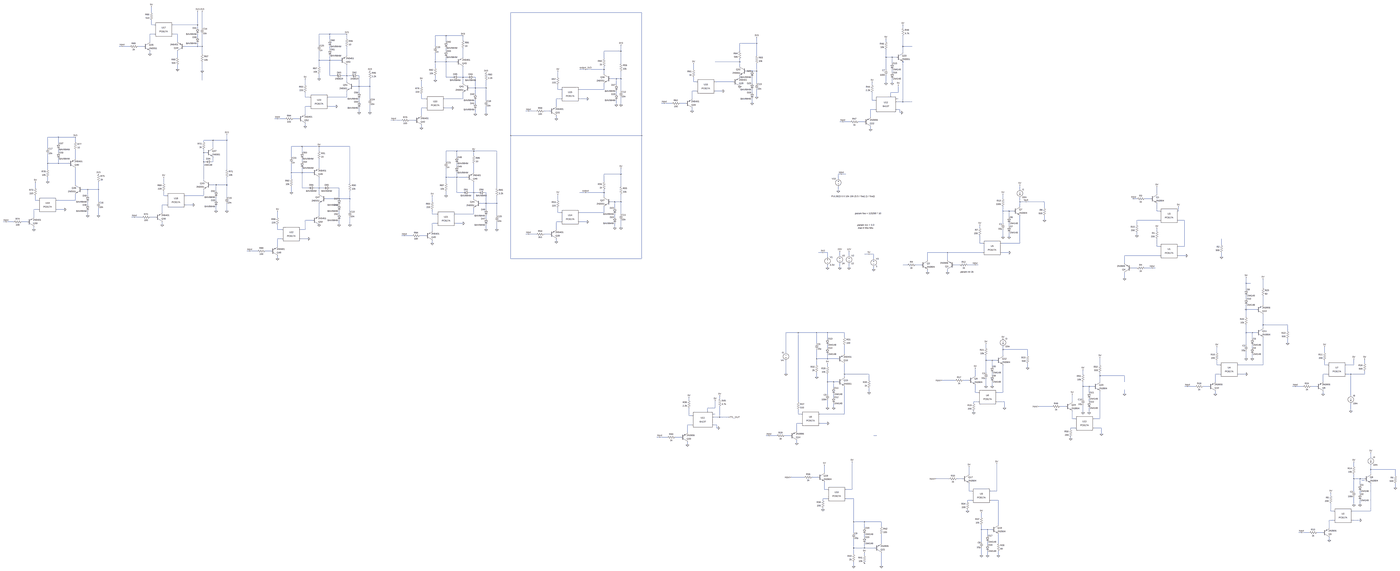
[diagram p0: schematic UART_isolation.asc, whole sheet]
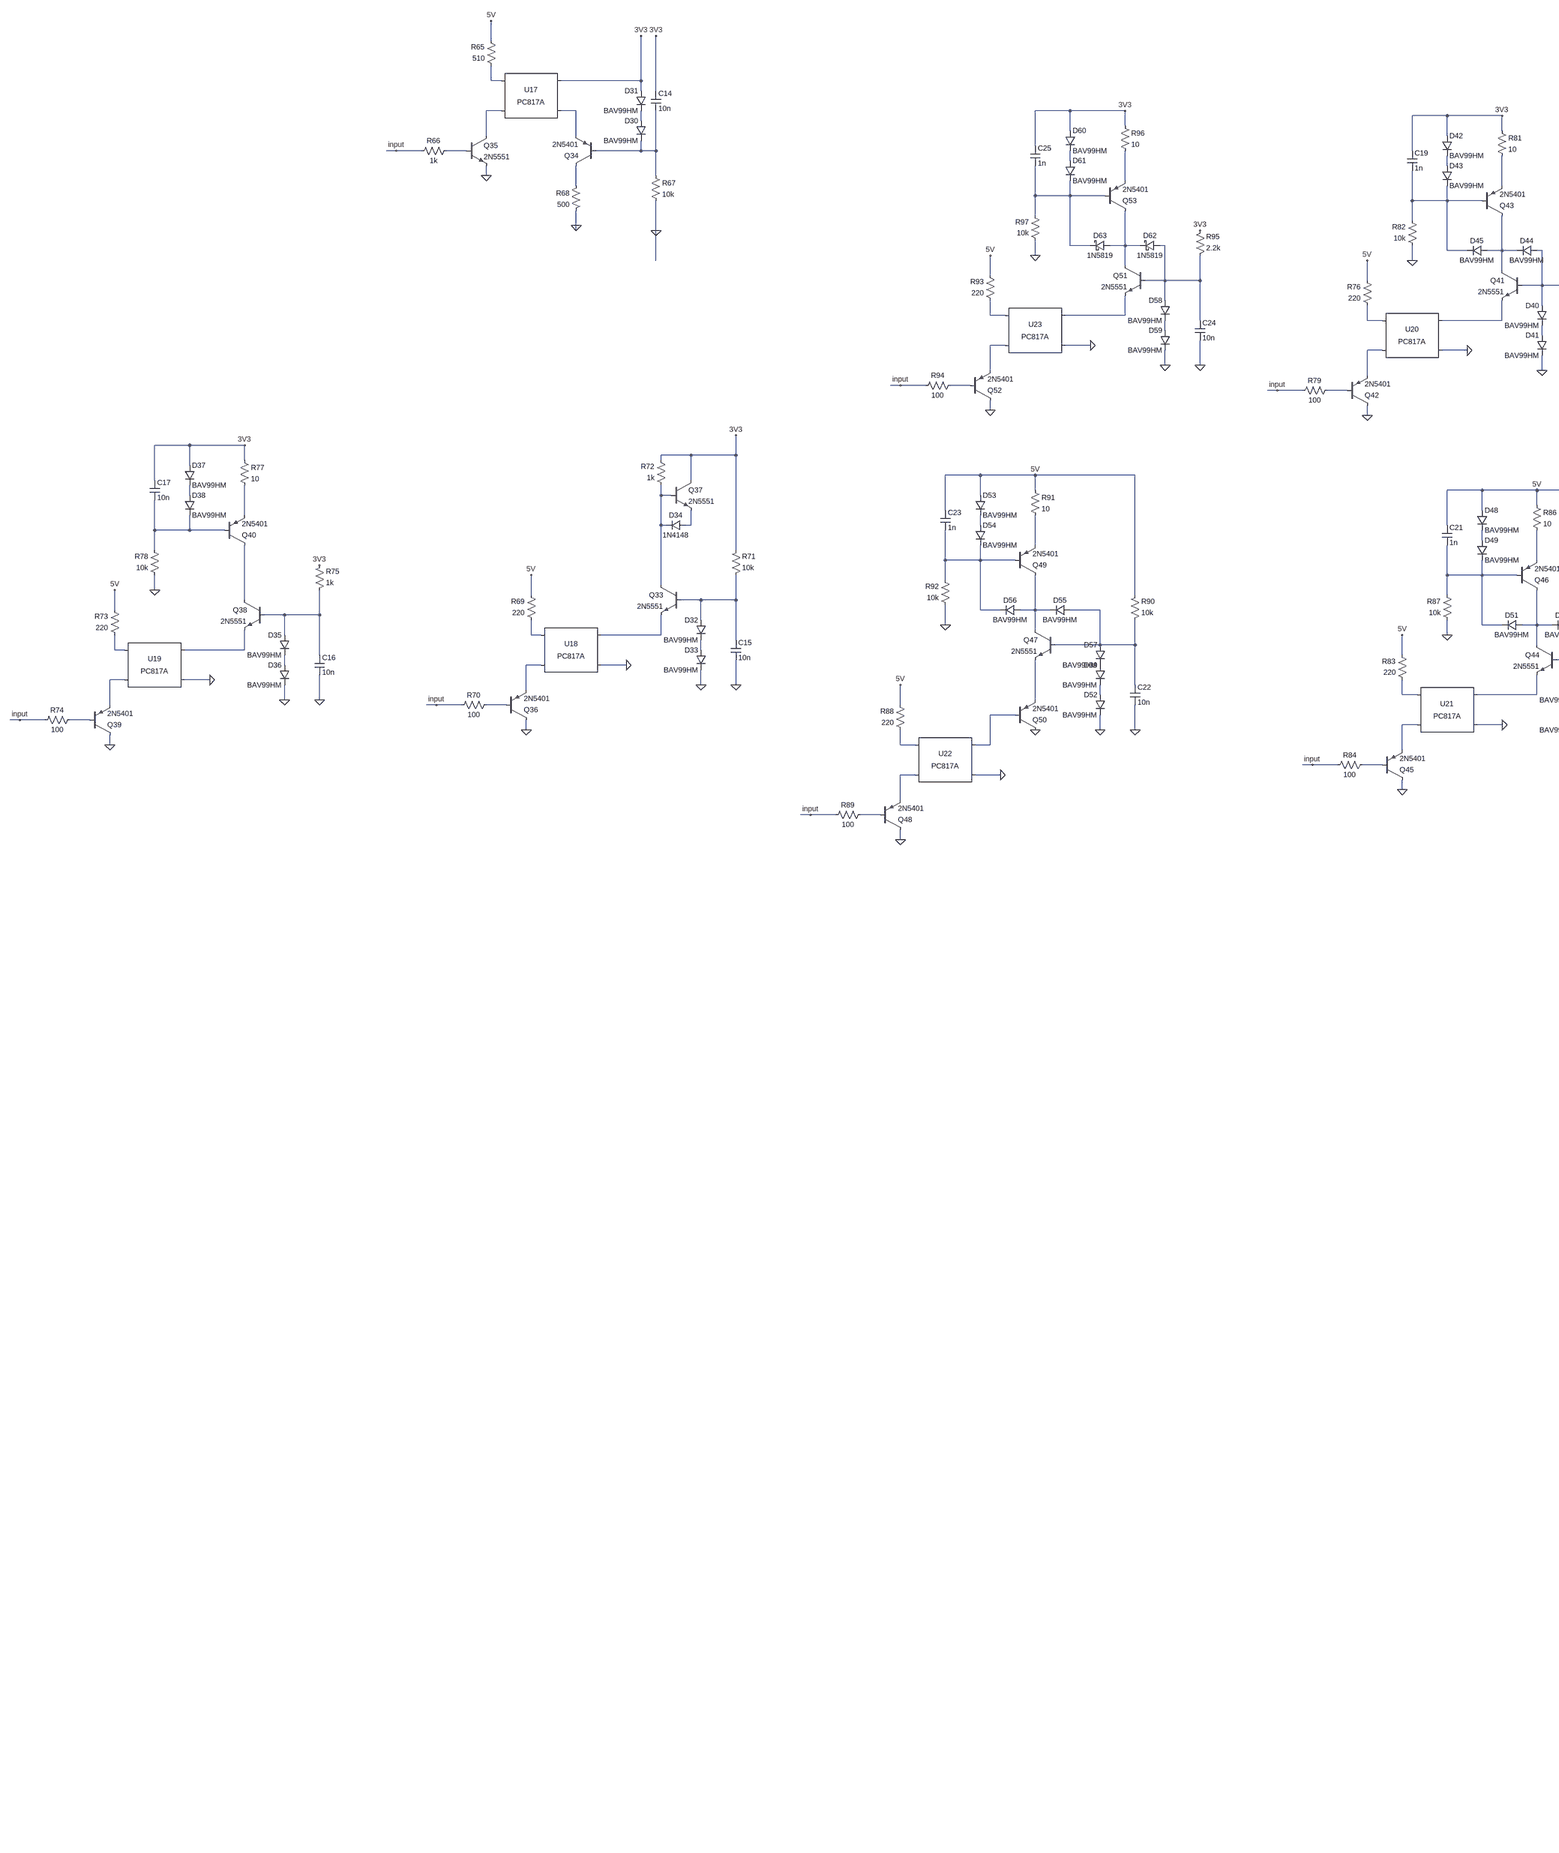
[diagram p1: schematic UART_isolation.asc, part, row 1 of 1, column 1 of 3]
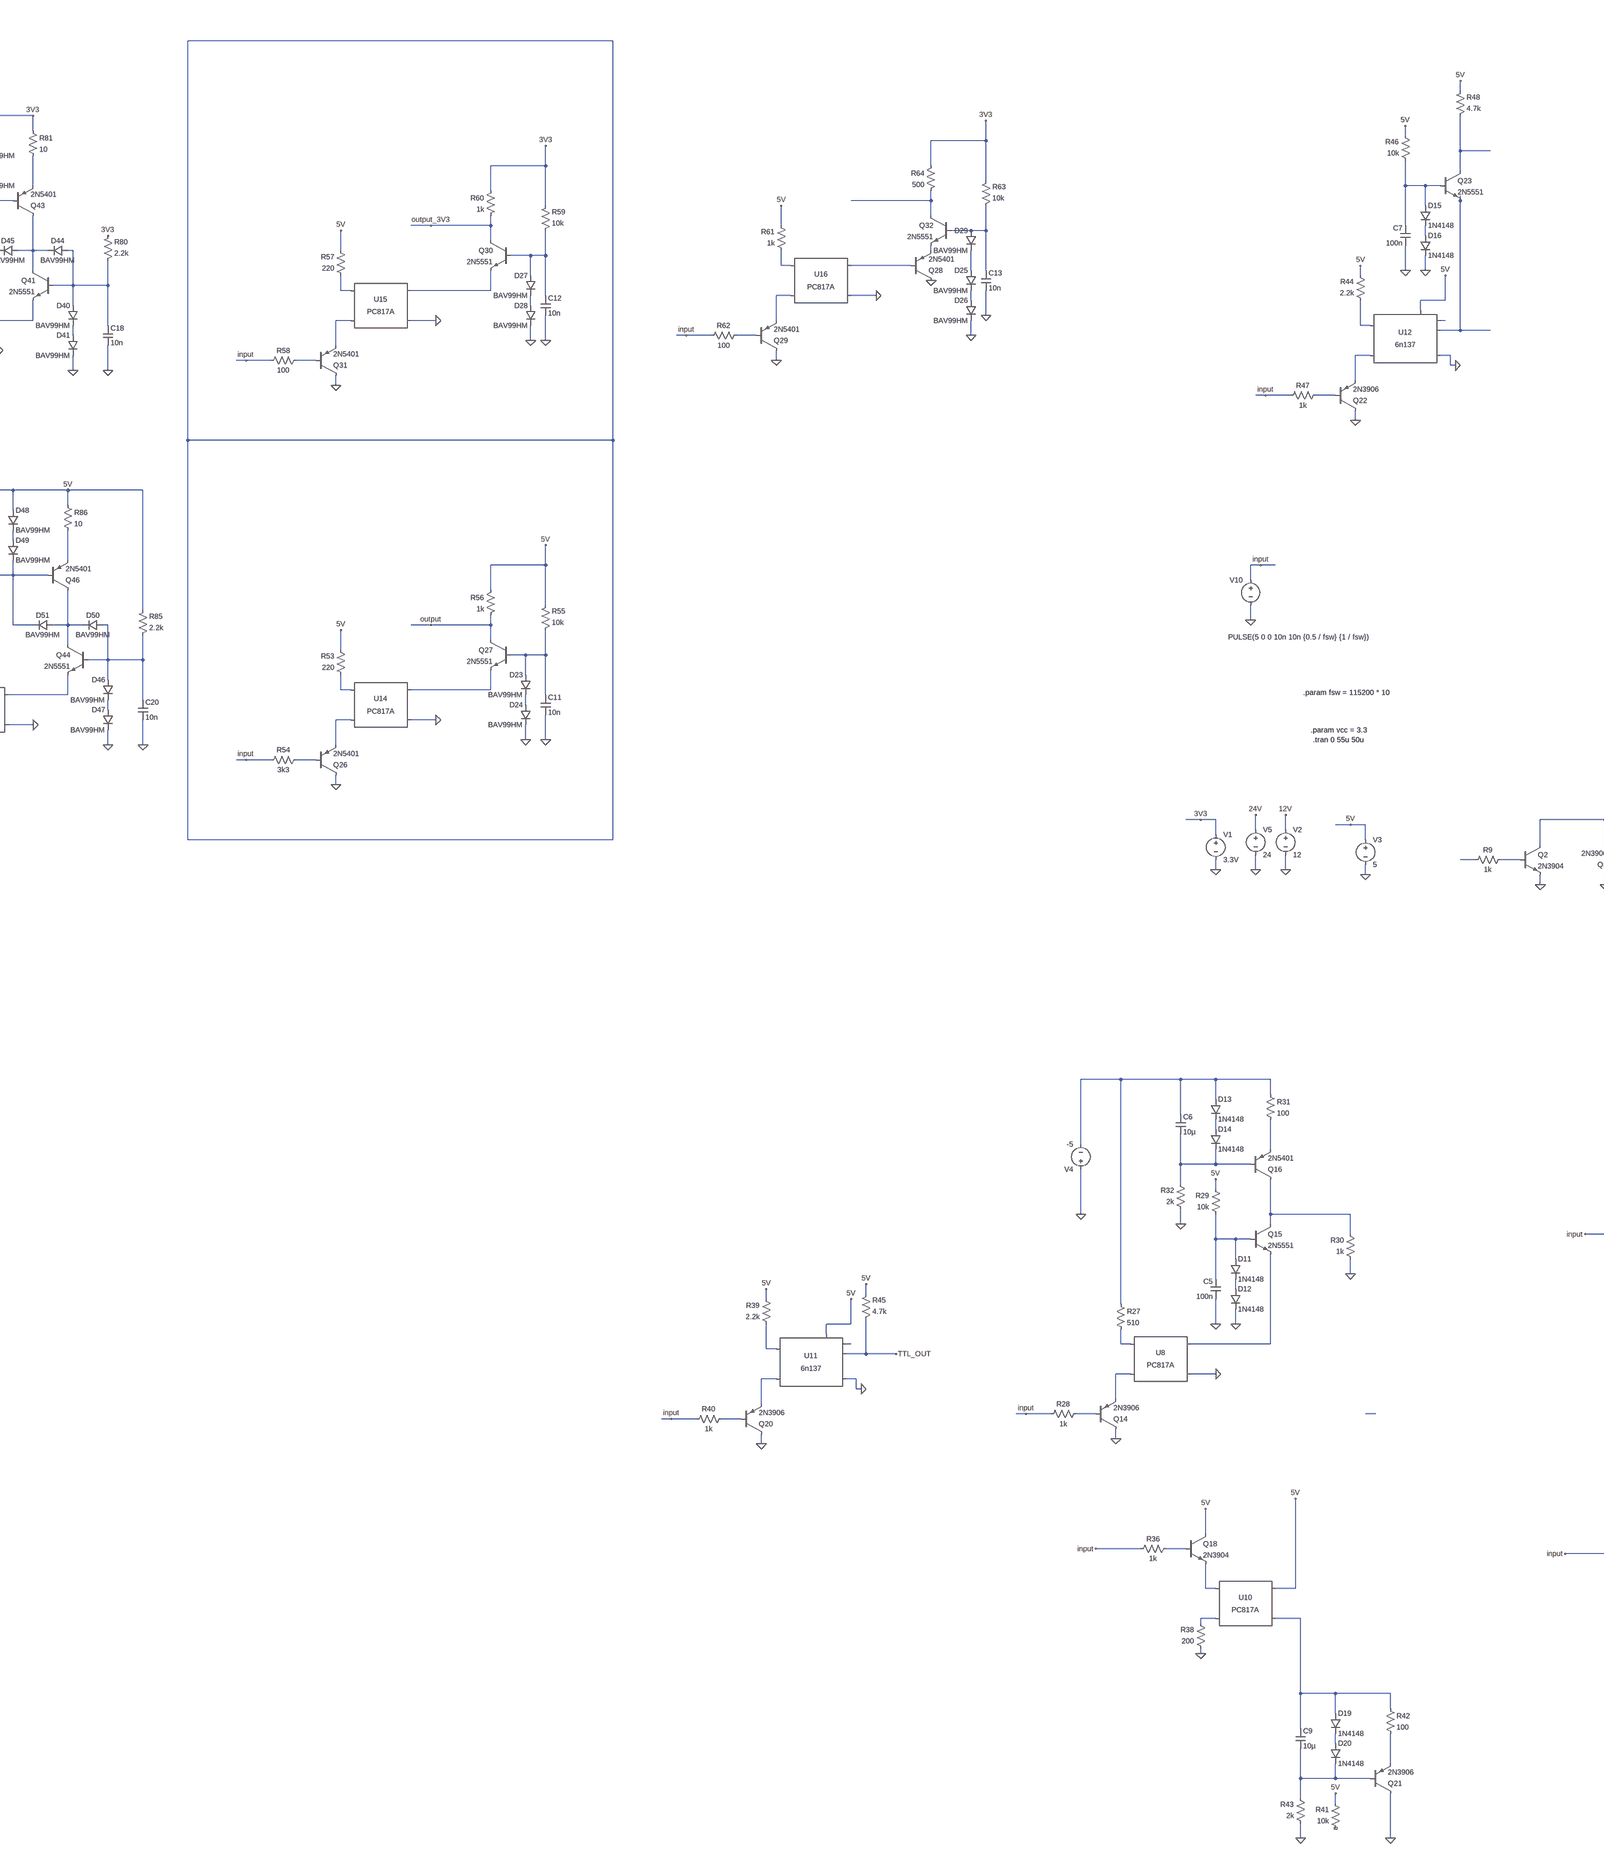
[diagram p2: schematic UART_isolation.asc, part, row 1 of 1, column 2 of 3]
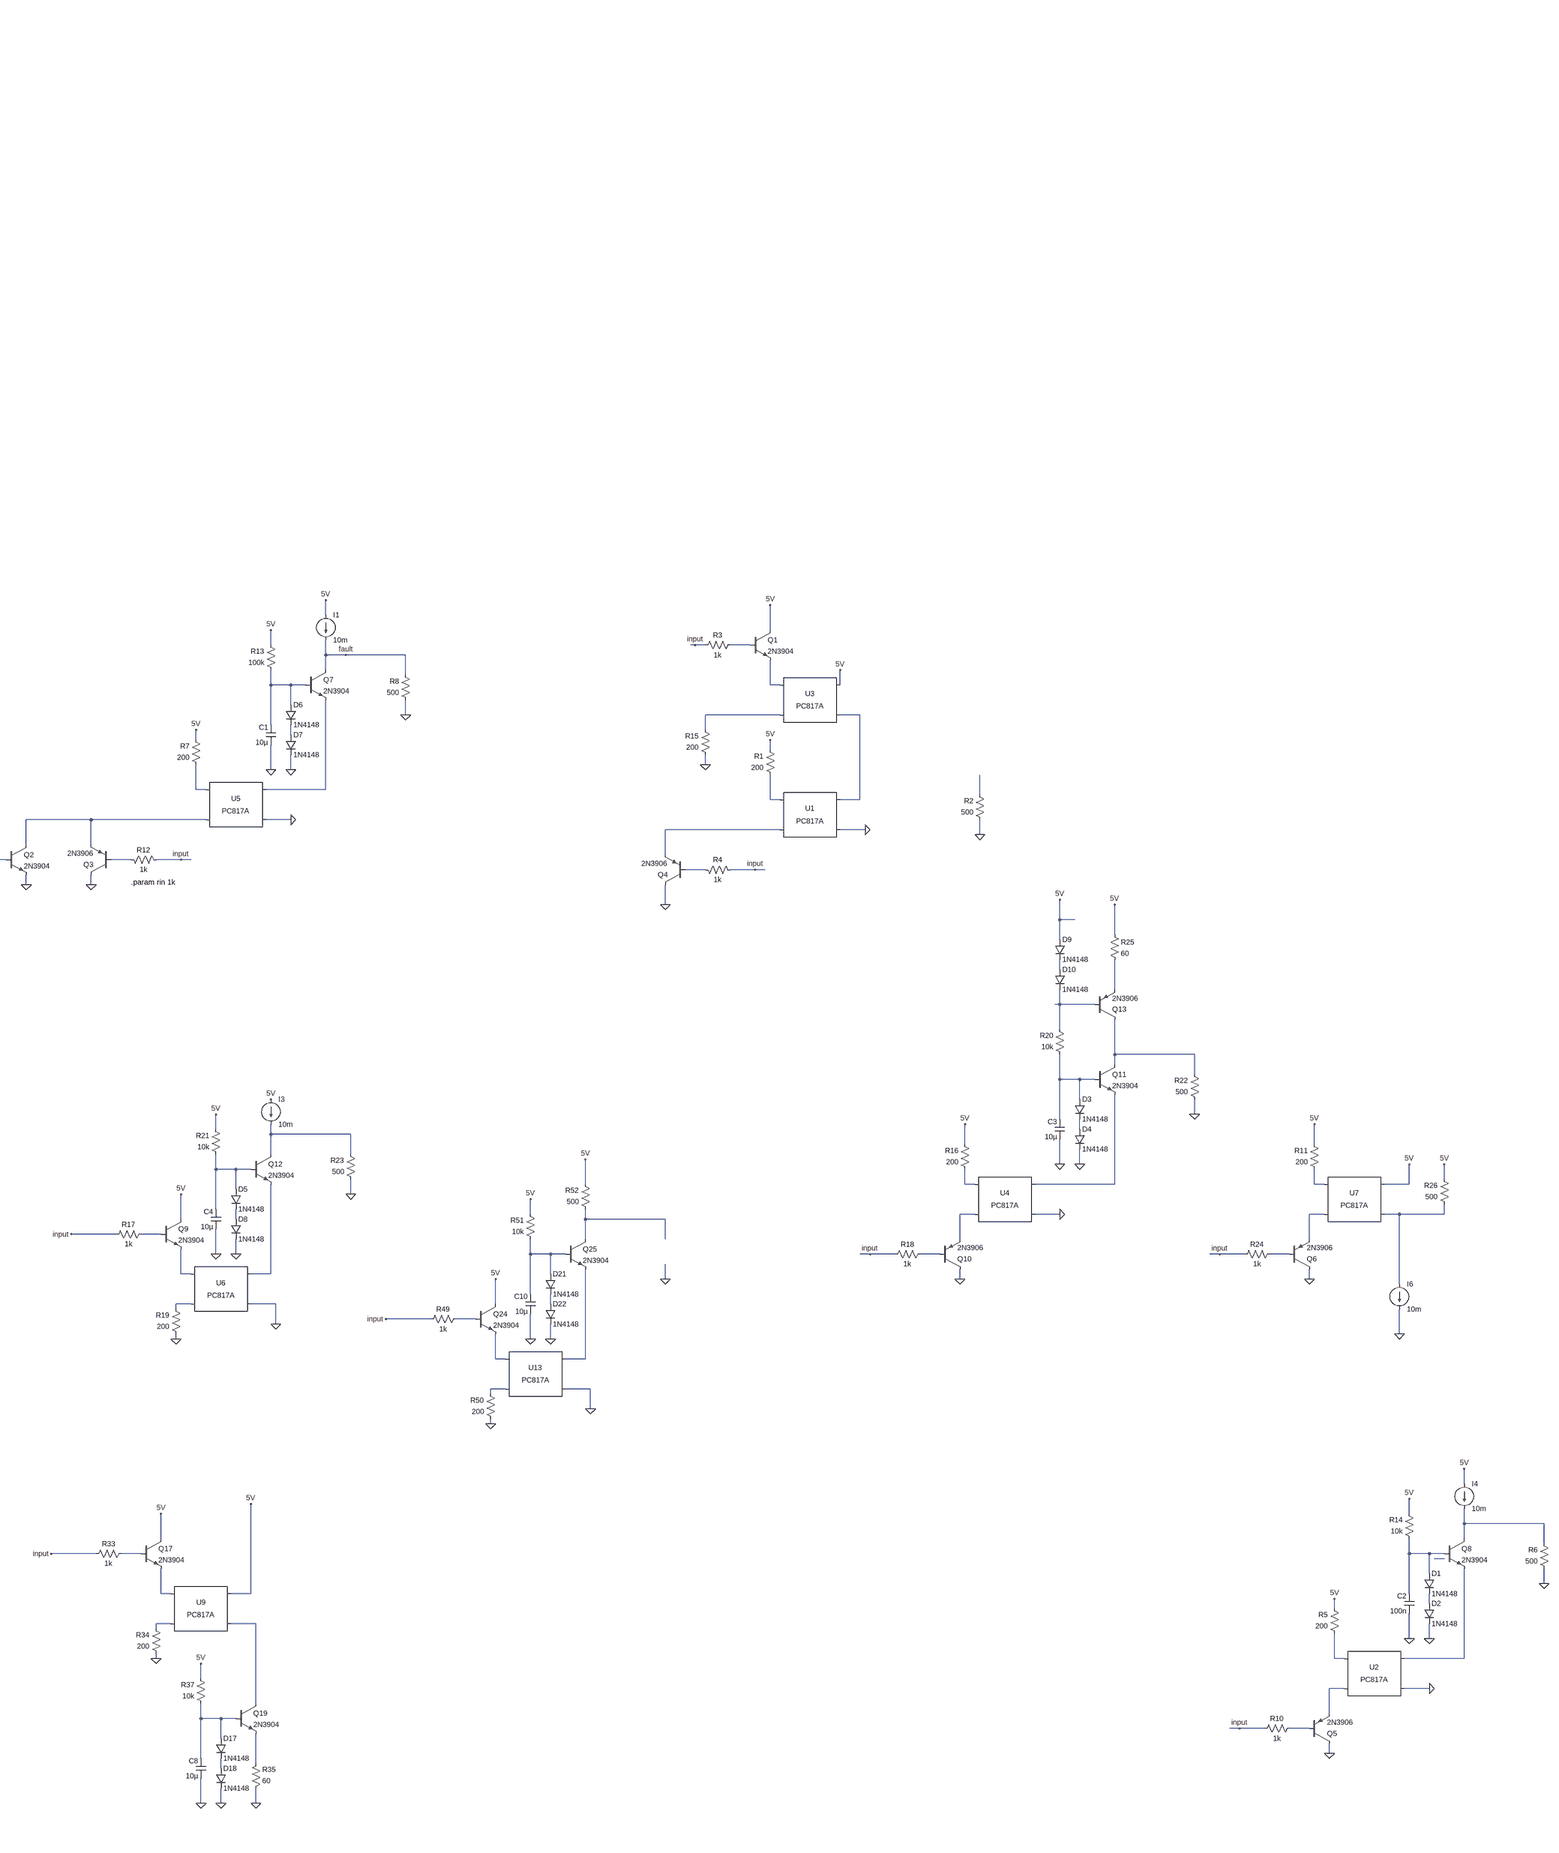
[diagram p3: schematic UART_isolation.asc, part, row 1 of 1, column 3 of 3]
* UART_isolation.asc
V2 12V 0 12
V1 3V3 0 3.3V
V5 24V 0 24
V10 input 0 PULSE(5 0 0 10n 10n {0.5 / fsw} {1 / fsw})
XU5 N102 N107 N103 0 PC817 Igain=1m
R7 N102 5V 200
R8 0 fault 500
Q2 N107 N110 0 0 2N3904
R9 N110 N109 1k
R12 N111 input 1k
Q3 0 N111 N107 0 2N3906
Q7 fault N080 N103 0 2N3904
D6 N080 N097 1N4148
D7 N097 0 1N4148
R13 N080 5V 100k
V3 5V 0 5
I1 5V fault 10m
C1 N080 0 10µ
XU1 N105 N108 N093 0 PC817 Igain=1m
R1 N105 5V 200
R2 0 N104 500
Q1 5V N072 N081 0 2N3904
R3 N072 input 1k
R4 N112 input 1k
Q4 0 N112 N108 0 2N3906
XU2 N169 N171 N170 0 PC817 Igain=1m
R5 N169 5V 200
R6 0 N157 500
Q8 N157 N160 N170 0 2N3904
D1 N160 N164 1N4148
D2 N164 0 1N4148
R14 N160 5V 10k
C2 N160 0 100n
XU3 N081 N092 5V N093 PC817 Igain=1m
R15 0 N092 200
XU4 N125 N129 N126 0 PC817 Igain=1m
R16 N125 5V 200
Q9 5V N134 N139 0 2N3904
R17 N134 input 1k
R18 N137 input 1k
Q10 0 N137 N129 0 2N3906
XU6 N139 N142 N140 0 PC817 Igain=1m
R19 0 N142 200
Q11 N116 N118 N126 0 2N3904
D3 N118 N120 1N4148
D4 N120 0 1N4148
R20 N118 N115 10k
C3 N118 0 10µ
Q12 N121 N124 N140 0 2N3904
D5 N124 N132 1N4148
D8 N132 0 1N4148
R21 N124 5V 10k
I3 5V N121 10m
C4 N124 0 10µ
R22 0 N116 500
R23 0 N121 500
I4 5V N157 10m
XU7 N127 N130 5V N131 PC817 Igain=1m
R11 N127 5V 200
R24 N138 input 1k
Q6 0 N138 N130 0 2N3906
R26 N131 5V 500
I6 N131 0 10m
Q13 N116 N115 N114 0 2N3906
D9 5V N113 1N4148
D10 N113 N115 1N4148
R25 5V N114 60
XU8 N146 N151 N147 0 PC817 Igain=1m
R27 N117 N146 510
R28 N154 input 1k
Q14 0 N154 N151 0 2N3906
Q15 N128 N135 N147 0 2N5551
D11 N135 N141 1N4148
D12 N141 0 1N4148
R29 N135 5V 10k
C5 N135 0 100n
R30 0 N128 1k
Q16 N128 N123 N122 0 2N5401
D13 N117 N119 1N4148
D14 N119 N123 1N4148
R31 N117 N122 100
R32 0 N123 2k
C6 N117 N123 10µ
V4 0 N117 -5
Q17 5V N159 N163 0 2N3904
R33 N159 input 1k
XU9 N163 N167 5V N168 PC817 Igain=1m
R34 0 N167 200
Q19 N168 N172 N176 0 2N3904
D17 N172 N177 1N4148
D18 N177 0 1N4148
R37 N172 5V 10k
C8 N172 0 10µ
R35 0 N176 60
Q18 5V N158 N162 0 2N3904
R36 N158 input 1k
XU10 N162 N165 5V N166 PC817 Igain=1m
R38 0 N165 200
R41 NC_01 5V 10k
Q21 0 N178 N175 0 2N3906
D19 N166 N174 1N4148
D20 N174 N178 1N4148
R42 N166 N175 100
R43 0 N178 2k
C9 N166 N178 10µ
XU11 N148 N152 0 TTL_OUT 5V N145 6n137
R39 N148 5V 2.2k
R45 TTL_OUT 5V 4.7k
R40 N156 input 1k
Q20 0 N156 N152 0 2N3906
XU12 N041 N047 0 N018 5V N040 6n137
R44 N041 5V 2.2k
R47 N051 input 1k
Q22 0 N051 N047 0 2N3906
Q23 N008 N014 N018 0 2N5551
D15 N014 N020 1N4148
D16 N020 0 1N4148
R46 N014 5V 10k
C7 N014 0 100n
R48 N008 5V 4.7k
Q24 5V N144 N149 0 2N3904
R49 N144 input 1k
XU13 N149 N153 N150 0 PC817 Igain=1m
R50 0 N153 200
Q25 N133 N136 N150 0 2N3904
D21 N136 N143 1N4148
D22 N143 0 1N4148
R51 N136 5V 10k
C10 N136 0 10µ
R52 N133 5V 500
XU14 N082 N095 N083 0 PC817 Igain=1m
R53 N082 5V 220
R54 N099 input 3k3
Q26 0 N099 N095 0 2N5401
Q27 output N076 N083 0 2N5551
D23 N076 N089 BAV99HM
R55 N076 5V 10k
C11 N076 0 10n
R56 5V output 1k
R10 N173 input 1k
Q5 0 N173 N171 0 2N3906
XU15 N030 N039 N031 0 PC817 Igain=1m
R57 N030 5V 220
R58 N048 input 100
R59 N026 3V3 10k
C12 N026 0 10n
R60 3V3 output_3V3 1k
Q30 output_3V3 N026 N031 0 2N5551
Q31 0 N048 N039 0 2N5401
D24 N089 0 BAV99HM
D27 N026 N034 BAV99HM
D28 N034 0 BAV99HM
XU16 N027 N032 N028 0 PC817 Igain=1m
R61 N027 5V 1k
R62 N044 input 100
R63 N019 3V3 10k
C13 N019 0 10n
R64 3V3 N017 500
Q29 0 N044 N032 0 2N5401
D25 N029 N033 BAV99HM
D26 N033 0 BAV99HM
Q28 0 N028 N025 0 2N5401
Q32 N017 N019 N025 0 2N5551
D29 N019 N029 BAV99HM
XU17 N002 N003 3V3 N004 PC817 Igain=1m
R65 N002 5V 510
R66 N006 input 1k
R67 N007 0 10k
C14 N007 3V3 10n
R68 N012 0 500
D30 N005 N007 BAV99HM
D31 3V3 N005 BAV99HM
Q35 N003 N006 0 0 2N5551
Q34 N012 N007 N004 0 2N5401
XU18 N070 N078 N071 0 PC817 Igain=1m
R69 N070 5V 220
R70 N088 input 100
R71 N064 3V3 10k
C15 N064 0 10n
Q33 N053 N064 N071 0 2N5551
Q36 0 N088 N078 0 2N5401
D32 N064 N075 BAV99HM
D33 N075 0 BAV99HM
Q37 3V3 N053 N055 0 2N5551
R72 N053 3V3 1k
D34 N055 N053 1N4148
XU19 N073 N079 N074 0 PC817 Igain=1m
R73 N073 5V 220
R74 N094 input 100
R75 N067 3V3 1k
C16 N067 0 10n
Q38 N063 N067 N074 0 2N5551
Q39 0 N094 N079 0 2N5401
D35 N067 N077 BAV99HM
D36 N077 0 BAV99HM
Q40 N063 N057 N054 0 2N5401
R77 3V3 N054 10
R78 0 N057 10k
C17 3V3 N057 10n
D37 3V3 N052 BAV99HM
D38 N052 N057 BAV99HM
XU20 N037 N046 N038 0 PC817 Igain=1m
R76 N037 5V 220
R79 N050 input 100
R80 N024 3V3 2.2k
C18 N024 0 10n
Q41 N023 N024 N038 0 2N5551
Q42 0 N050 N046 0 2N5401
D40 N024 N043 BAV99HM
D41 N043 0 BAV99HM
Q43 N023 N016 N013 0 2N5401
R81 3V3 N013 10
R82 0 N016 10k
C19 3V3 N016 1n
D42 3V3 N010 BAV99HM
D43 N010 N016 BAV99HM
D44 N024 N023 BAV99HM
D45 N023 N016 BAV99HM
XU21 N085 N096 N086 0 PC817 Igain=1m
R83 N085 5V 220
R84 N100 input 100
R85 N069 5V 2.2k
C20 N069 0 10n
Q44 N068 N069 N086 0 2N5551
Q45 0 N100 N096 0 2N5401
D46 N069 N090 BAV99HM
D47 N090 0 BAV99HM
Q46 N068 N062 N061 0 2N5401
R86 5V N061 10
R87 0 N062 10k
C21 5V N062 1n
D48 5V N058 BAV99HM
D49 N058 N062 BAV99HM
D50 N069 N068 BAV99HM
D51 N068 N062 BAV99HM
XU22 N098 N101 N091 0 PC817 Igain=1m
R88 N098 5V 220
R89 N106 input 100
R90 N066 5V 10k
C22 N066 0 10n
Q47 N065 N066 N087 0 2N5551
Q48 0 N106 N101 0 2N5401
D39 P001 N084 BAV99HM
D52 N084 0 BAV99HM
Q49 N065 N060 N059 0 2N5401
R91 5V N059 10
R92 0 N060 10k
C23 5V N060 1n
D53 5V N056 BAV99HM
D54 N056 N060 BAV99HM
D55 N066 N065 BAV99HM
D56 N065 N060 BAV99HM
Q50 0 N091 N087 0 2N5401
D57 N066 P001 BAV99HM
XU23 N035 N045 N036 0 PC817 Igain=1m
R93 N035 5V 220
R94 N049 input 100
R95 N022 3V3 2.2k
C24 N022 0 10n
Q51 N021 N022 N036 0 2N5551
Q52 0 N049 N045 0 2N5401
D58 N022 N042 BAV99HM
D59 N042 0 BAV99HM
Q53 N021 N015 N011 0 2N5401
R96 3V3 N011 10
R97 0 N015 10k
C25 3V3 N015 1n
D60 3V3 N009 BAV99HM
D61 N009 N015 BAV99HM
D63 N021 N015 1N5819
D62 N022 N021 1N5819
.model D D
.lib standard.dio
.model NPN NPN
.model PNP PNP
.lib standard.bjt
.tran 0 55u 50u
.param vcc = 3.3
.param rin 1k
.param fsw = 115200 * 10
.lib PC817.sub
.backanno
.end